# EAGLE design beacon (EAGLE 9.3.1)
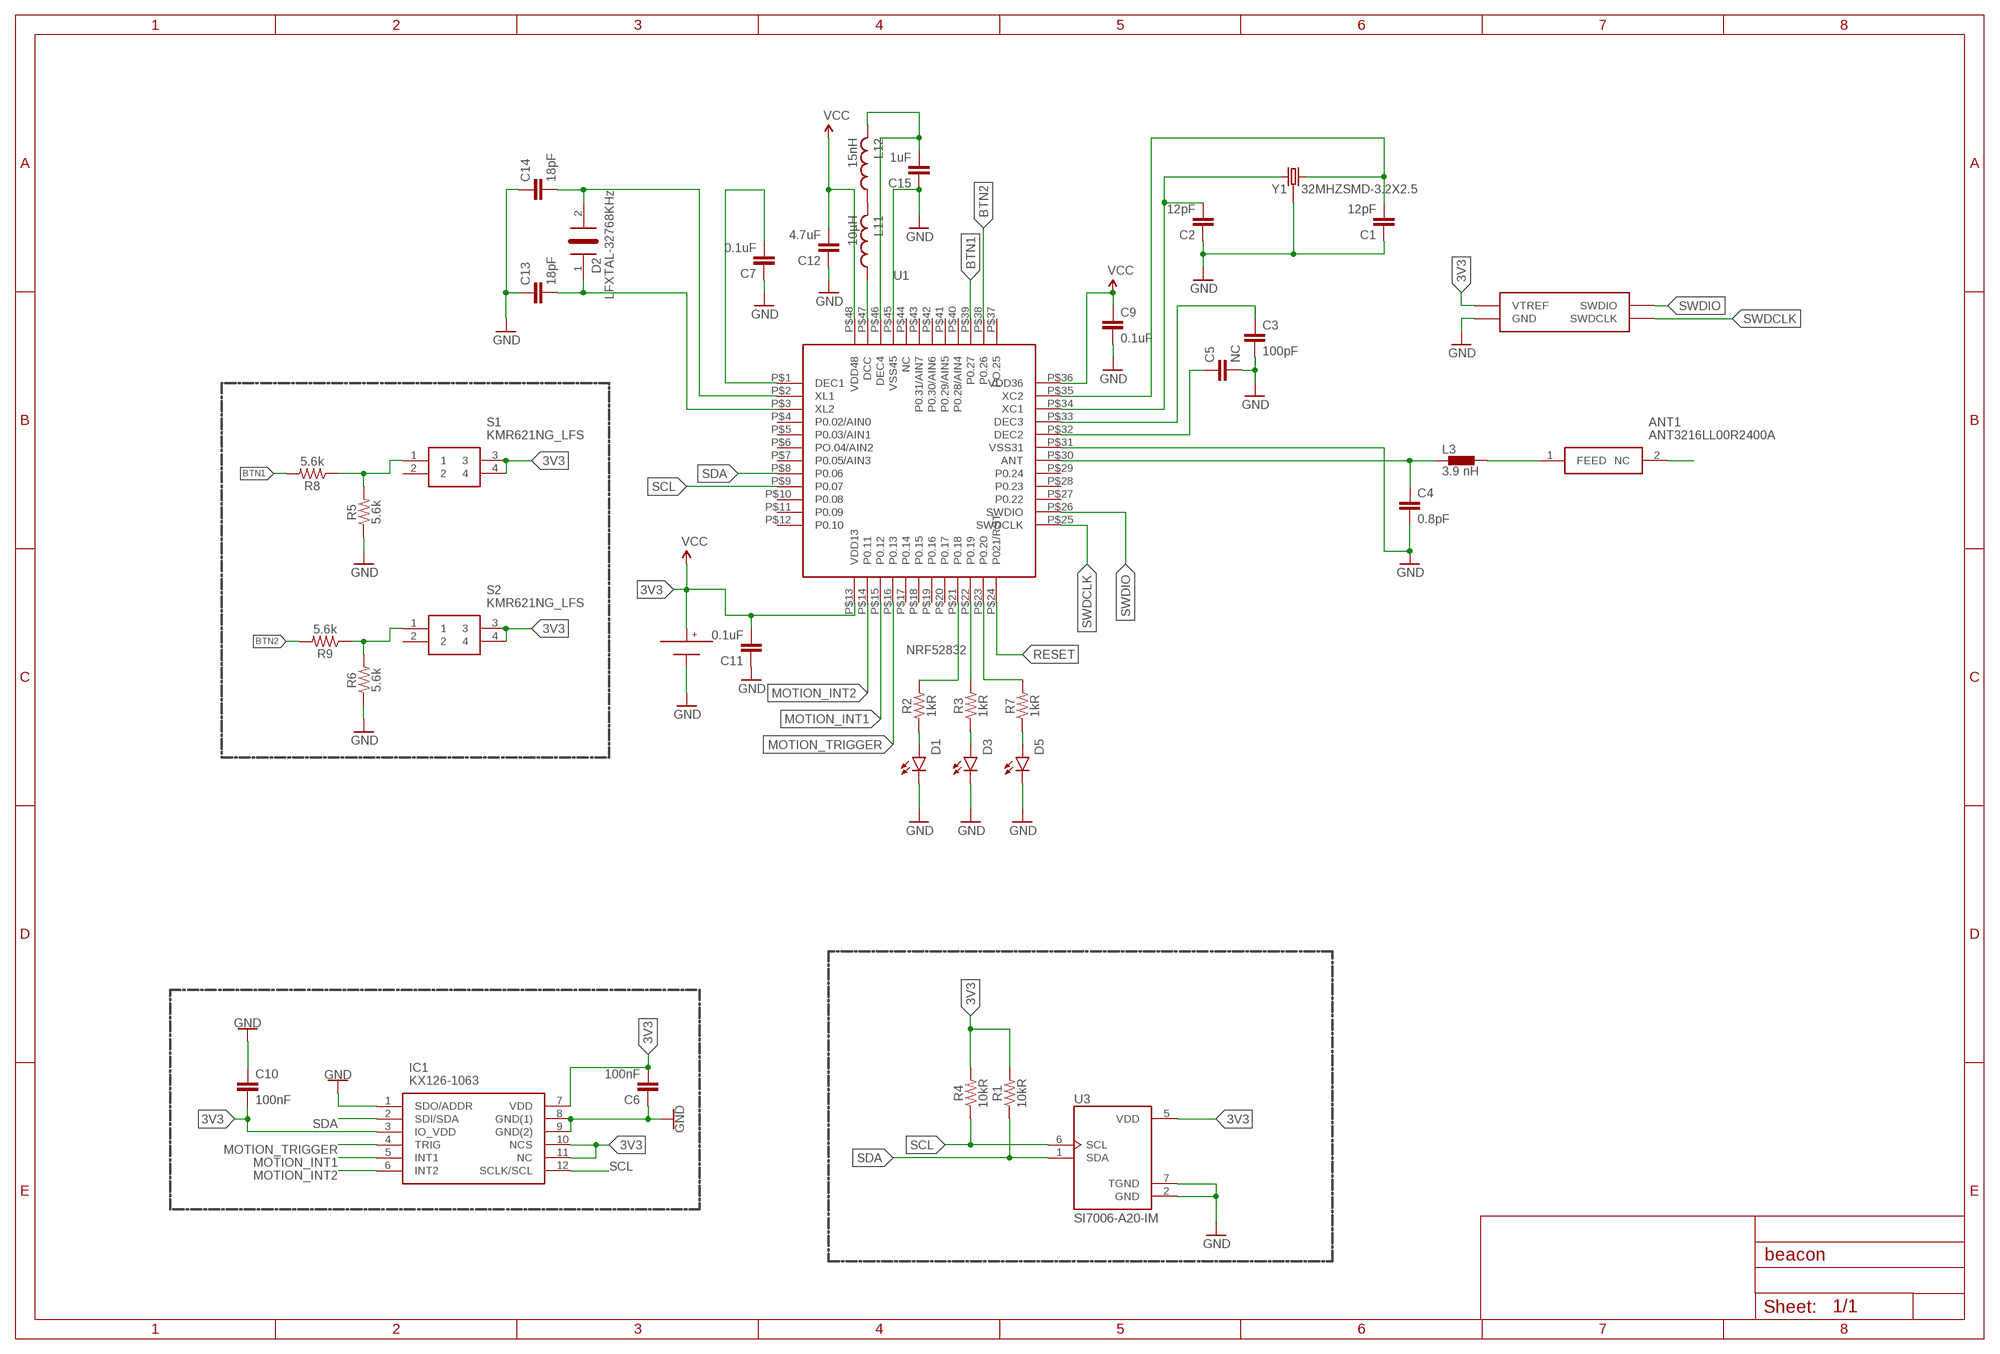
[diagram p0: schematic, sheet 1]

## Parts
ANT1  ANT3216LL00R2400A  [ANTC3216X135N]
C1  12pF  0.1UF-0603-25V-5%  [0603]
C2  12pF  0.1UF-0603-25V-5%  [0603]
C3  100pF  0.1UF-0603-25V-5%  [0603]
C4  0.8pF  0.1UF-0603-25V-5%  [0603]
C5  NC  0.1UF-0603-25V-5%  [0603]
C6  100nF  1.5PF-0603-50V-16.667%  [0603]
C7  0.1uF  0.1UF-0603-25V-5%  [0603]
C9  0.1uF  0.1UF-0603-25V-5%  [0603]
C10  100nF  1.5PF-0603-50V-16.667%  [0603]
C11  0.1uF  0.1UF-0603-25V-5%  [0603]
C12  4.7uF  0.1UF-0603-25V-5%  [0603]
C13  18pF  0.1UF-0603-25V-5%  [0603]
C14  18pF  0.1UF-0603-25V-5%  [0603]
C15  1uF  0.1UF-0603-25V-5%  [0603]
D1  LED0603  [LED-0603]
D2  LFXTAL-32768KHz  LFXTAL009678  [DIOC3215X90N]
D3  LED0603  [LED-0603]
D5  LED0603  [LED-0603]
IC1  KX126-1063  [2X2X0.9MMLGA]
J1  JTAG-PROGJTAG_SMALL  [JTAG_PROG_SMALL]
L3  3.9 nH  0402IND.KW  [0402]
L11  10µH  INDUCTOR_0603_N  [RESC0603_N]
L12  15nH  INDUCTOR_0402_N  [RESC0402_N]
R1  10kR  5.6KOHM-0603-1/10W-1%  [0603]
R2  1kR  5.6KOHM-0603-1/10W-1%  [0603]
R3  1kR  5.6KOHM-0603-1/10W-1%  [0603]
R4  10kR  5.6KOHM-0603-1/10W-1%  [0603]
R5  5.6k  5.6KOHM-0603-1/10W-1%  [0603]
R6  5.6k  5.6KOHM-0603-1/10W-1%  [0603]
R7  1kR  5.6KOHM-0603-1/10W-1%  [0603]
R8  5.6k  5.6KOHM-0603-1/10W-1%  [0603]
R9  5.6k  5.6KOHM-0603-1/10W-1%  [0603]
S1  KMR621NG_LFS  [KMR621NG]
S2  KMR621NG_LFS  [KMR621NG]
U1  NRF52832  [QFN-48]
U3  SI7006-A20-IM  [SON100P300X300X80-7N]
U$1  BAT-HLD-001  [BAT-HLD-001]
Y1  32MHZSMD-3.2X2.5  CRYSTAL-26MHZSMD-3.2X2.5  [CRYSTAL-SMD-3.2X2.5MM]

## Nets
3V3: C6.2 C9.1 C10.2 C11.2 C12.2 IC1.3(IO_VDD) IC1.7(VDD) IC1.10(NCS) IC1.11(NC) J1.VREF(VTREF) R1.2 R4.2 S1.3 S1.4 S2.3 S2.4 U1.P$13(VDD13) U1.P$36(VDD36) U1.P$48(VDD48) U3.5(VDD) U$1.+@1(+) U$1.+@2(+) ; supply symbol labelled VCC
BTN1: R8.2 U1.P$39(P0.27)
BTN2: R9.2 U1.P$38(P0.26)
DEC4: C15.2 L12.2 U1.P$46(DEC4)
GND: C1.1 C2.1 C3.2 C4.2 C5.2 C6.1 C7.1 C9.2 C10.1 C11.1 C12.1 C13.1 C14.1 C15.1 D1.C D3.C D5.C IC1.1(SDO/ADDR) IC1.8(GND(1)) IC1.9(GND(2)) J1.GND R5.1 R6.1 U1.P$31(VSS31) U1.P$45(VSS45) U3.2(GND) U3.7(TGND) U$1.- Y1.2 Y1.4
MOTION_INT1: IC1.5(INT1) U1.P$15(P0.12)
MOTION_INT2: IC1.6(INT2) U1.P$14(P0.11)
MOTION_TRIGGER: IC1.4(TRIG) U1.P$16(P0.13)
N$1: ANT1.1(FEED) L3.2
N$2: C2.2 U1.P$34(XC1) Y1.1
N$3: C4.1 L3.1 U1.P$30(ANT)
N$4: C14.2 D2.2(A) U1.P$2(XL1)
N$5: R7.2 U1.P$23(P0.20)
N$6: ANT1.2(NC)
N$7: R3.2 U1.P$22(P0.19)
N$8: R2.2 U1.P$21(P0.18)
N$9: C13.2 D2.1(K) U1.P$3(XL2)
N$10: C1.2 U1.P$35(XC2) Y1.3
N$11: R5.2 R8.1 S1.1
N$12: C7.2 U1.P$1(DEC1)
N$14: R6.2 R9.1 S2.1
N$16: D1.A R2.1
N$18: D3.A R3.1
N$19: D5.A R7.1
N$27: L11.2 L12.1
N$28: C3.1 U1.P$33(DEC3)
N$29: L11.1 U1.P$47(DCC)
N$47: C5.1 U1.P$32(DEC2)
RESET: U1.P$24(P021/RST)
SCL: IC1.12(SCLK/SCL) R4.1 U1.P$9(P0.07) U3.6(SCL)
SDA: IC1.2(SDI/SDA) R1.1 U1.P$8(P0.06) U3.1(SDA)
SWDCLK: J1.SCK(SWDCLK) U1.P$25(SWDCLK)
SWDIO: J1.DIO(SWDIO) U1.P$26(SWDIO)
Unconnected: S1.2 S2.2 U1.P$4(P0.02/AIN0) U1.P$5(P0.03/AIN1) U1.P$6(PO.04/AIN2) U1.P$7(P0.05/AIN3) U1.P$10(P0.08) U1.P$11(P0.09) U1.P$12(P0.10) U1.P$17(P0.14) U1.P$18(P0.15) U1.P$19(P0.16) U1.P$20(P0.17) U1.P$27(P0.22) U1.P$28(P0.23) U1.P$29(P0.24) U1.P$37(PO.25) U1.P$40(P0.28/AIN4) U1.P$41(P0.29/AIN5) U1.P$42(P0.30/AIN6) U1.P$43(P0.31/AIN7) U1.P$44(NC)

## Library data of the parts
ANT1 = IoTMakers:ANT3216LL00R2400A: Antennas 1W 2.4-2.5GHz ANTENNA Source: Datasheet <https://componentsearchengine.com/Datasheets/1/ANT3216LL00R2400A.pdf>; DESCRIPTION: Antennas 1W 2.4-2.5GHz ANTENNA; HEIGHT: 1.35mm; MANUFACTURER_NAME: YAGEO (PHYCOMP); MANUFACTURER_PART_NUMBER: ANT3216LL00R2400A; MOUSER_PART_NUMBER: 603-ANT3216LL00R2400
C1-C5 C12-C15 = SparkFun-Capacitors:0.1UF: 0.1µF ceramic capacitors A capacitor is a passive two-terminal electrical component used to store electrical energy temporarily in an electric field.; PROD_ID: CAP-08604; VALUE: 0.1uF
C6 C10 = SparkFun-Capacitors:1.5PF: 1.5pF ceramic capacitors A capacitor is a passive two-terminal electrical component used to store electrical energy temporarily in an electric field.; PROD_ID: CAP-08763; VALUE: 1.5pF
C7 C9 C11 = SparkFun-Capacitors:0.1UF: 0.1µF ceramic capacitors A capacitor is a passive two-terminal electrical component used to store electrical energy temporarily in an electric field.; PROD_ID: CAP-08604
D1 D3 D5 = SparkFun-LED:LED: LED (Generic) Standard schematic elements and footprints for 5mm, 3mm, 1206, and 0603 sized LEDs. Generic LEDs with no color specified.
D2 = SamacSys:LFXTAL009678: IQD FREQUENCY PRODUCTS - LFXTAL009678 - CRYSTAL, 32.768KHZ, 12.5PF, SMD Source: Datasheet <http://www.farnell.com/datasheets/1852967.pdf>; ARROW_PART_NUMBER: LFXTAL009678; ARROW_PRICE/STOCK: http://uk.rs-online.com/web/p/products/1463933; DESCRIPTION: IQD FREQUENCY PRODUCTS - LFXTAL009678 - CRYSTAL, 32.768KHZ, 12.5PF, SMD; HEIGHT: 0.9mm; MANUFACTURER_NAME: IQD; MANUFACTURER_PART_NUMBER: LFXTAL009678; RS_PART_NUMBER: 1463933; RS_PRICE/STOCK: http://uk.rs-online.com/web/p/products/1463933
IC1 = IoTMakers:KX126-1063: TRI-AXIS, USER SELECTABLE 2G, 4G, 8G, DIGITAL (I2C/SPI) OUTPUT, INTEGRATED PEDOMETER, FIFO/FILO BUFFER, 2X2X0.9MM LGA - KX126-1063 Source: Datasheet <http://kionixfs.kionix.com/en/datasheet/KX126-1063-Specifications-Rev-1.0.pdf>; DESCRIPTION: TRI-AXIS, USER SELECTABLE 2G, 4G, 8G, DIGITAL (I2C/SPI) OUTPUT, INTEGRATED PEDOMETER, FIFO/FILO BUFFER, 2X2X0.9MM LGA - KX126-1063; DIGIKEY_PART_NUMBER: 1191-1058-2-ND; HEIGHT: mm; MANUFACTURER_NAME: Kionix; MANUFACTURER_PART_NUMBER: KX126-1063
J1 = IoTMakers:JTAG-PROG
L3 = inductors:0402IND.KW
L11 L12 = Nordic_nRF:INDUCTOR: Generic chip inductor
R1-R4 R7 = SparkFun-Resistors:5.6KOHM: 5.6kΩ resistor A resistor is a passive two-terminal electrical component that implements electrical resistance as a circuit element. Resistors act to reduce current flow, and, at the same time, act to lower voltage levels within circuits. - Wikipedia; PROD_ID: RES-12378; VALUE: 5.6k
R5 R6 R8 R9 = SparkFun-Resistors:5.6KOHM: 5.6kΩ resistor A resistor is a passive two-terminal electrical component that implements electrical resistance as a circuit element. Resistors act to reduce current flow, and, at the same time, act to lower voltage levels within circuits. - Wikipedia; PROD_ID: RES-12378
S1 S2 = SamacSys:KMR621NG_LFS: IP67 Black Button Tactile Switch, SPST-NO 50 mA 2.11mm Surface Mount Source: Datasheet <http://www.ckswitches.com/media/1907/kmr6.pdf>; ARROW_PART_NUMBER: KMR621NG LFS; ARROW_PRICE/STOCK: https://www.arrow.com/en/products/kmr621nglfs/ck; DESCRIPTION: IP67 Black Button Tactile Switch, SPST-NO 50 mA 2.11mm Surface Mount; HEIGHT: mm; MANUFACTURER_NAME: C & K COMPONENTS; MANUFACTURER_PART_NUMBER: KMR621NG LFS; RS_PART_NUMBER: 1359408P; RS_PRICE/STOCK: http://uk.rs-online.com/web/p/products/1359408P
U1 = Kris:NRF52832: nRF52832 QFAA QFN-48 SoC
U3 = IoTMakers:SI7006-A20-IM: SENS HUMI/TEMP 3.6V I2C 5% 6DFN; AVAILABILITY: Unavailable; DESCRIPTION: Temp/Humidity Sensor, +/-1deg c, Dfn-6; MF: Silicon Labs; MP: SI7006-A20-IM; PACKAGE: DFN-6 Silicon Labs; PRICE: None
U$1 = IoTMakers:BAT-HLD-001: Linx Technologies BAT-HLD-001 surface mount CR2032 single-cell holder digikey: BAT-HLD-001-ND; AVAILABILITY: Unavailable; DESCRIPTION: CR2032 Phosphor Bronze / Nickel Plated 20 mm Cell Size Battery Holder; MF: Linx; MP: BAT-HLD-001; PACKAGE: None; PRICE: None
Y1 = IoTMakers:CRYSTAL-26MHZ: 26MHz Crystal w/ Ground Pin Digikey Example <http://www.digikey.com/product-detail/en/epson/TSX-3225%2026.0000MF09Z-AC3/SER3627CT-ND/1802878> Frequency: 26MHz Frequency Stability: ±9ppm Frequency Tolerance: ±10ppm Load Capacitance: 9pF SparkFun Products: SparkFun ESP32 Thing <https://www.sparkfun.com/products/13907> SparkFun ESP8266 Thing Dev Board <https://www.sparkfun.com/products/13711>; PROD_ID: XTAL-12454

## Board
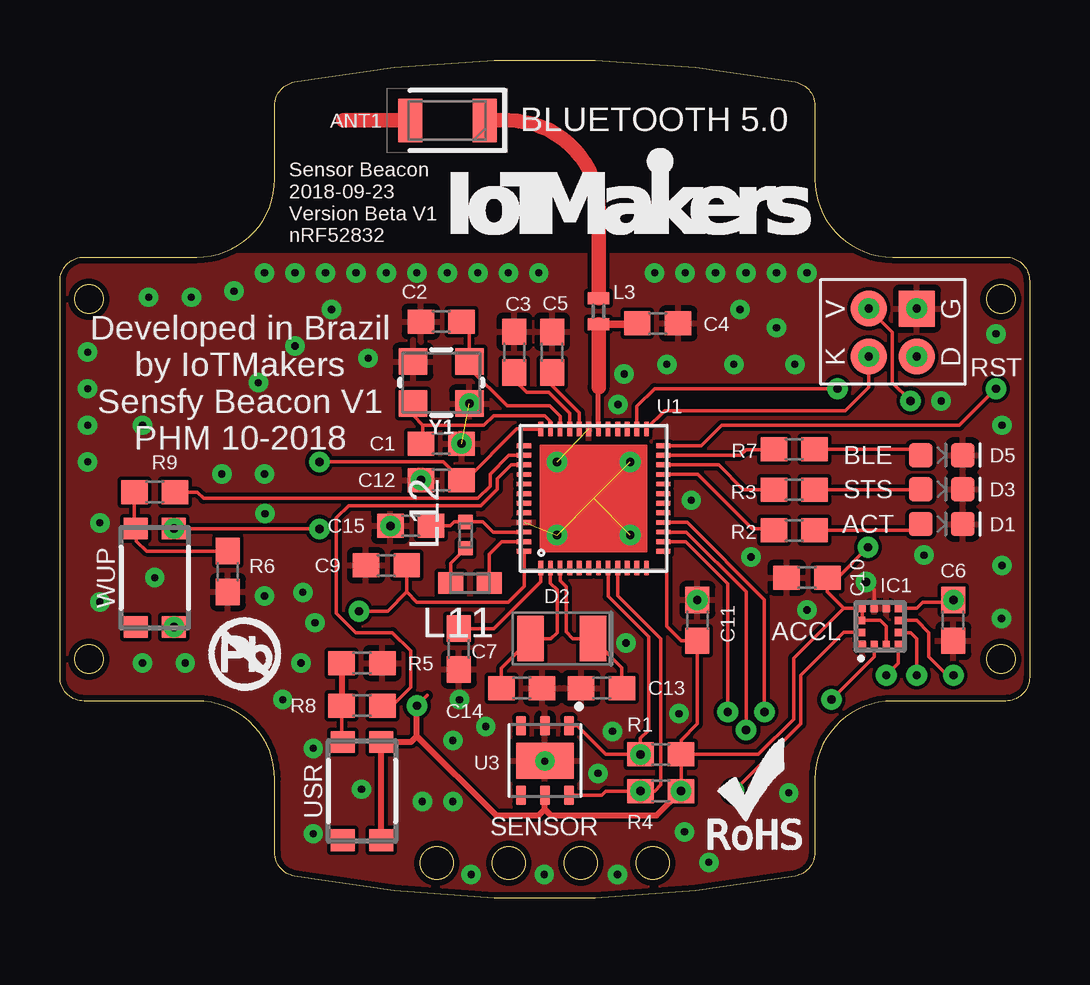
[diagram p1: board, top side]
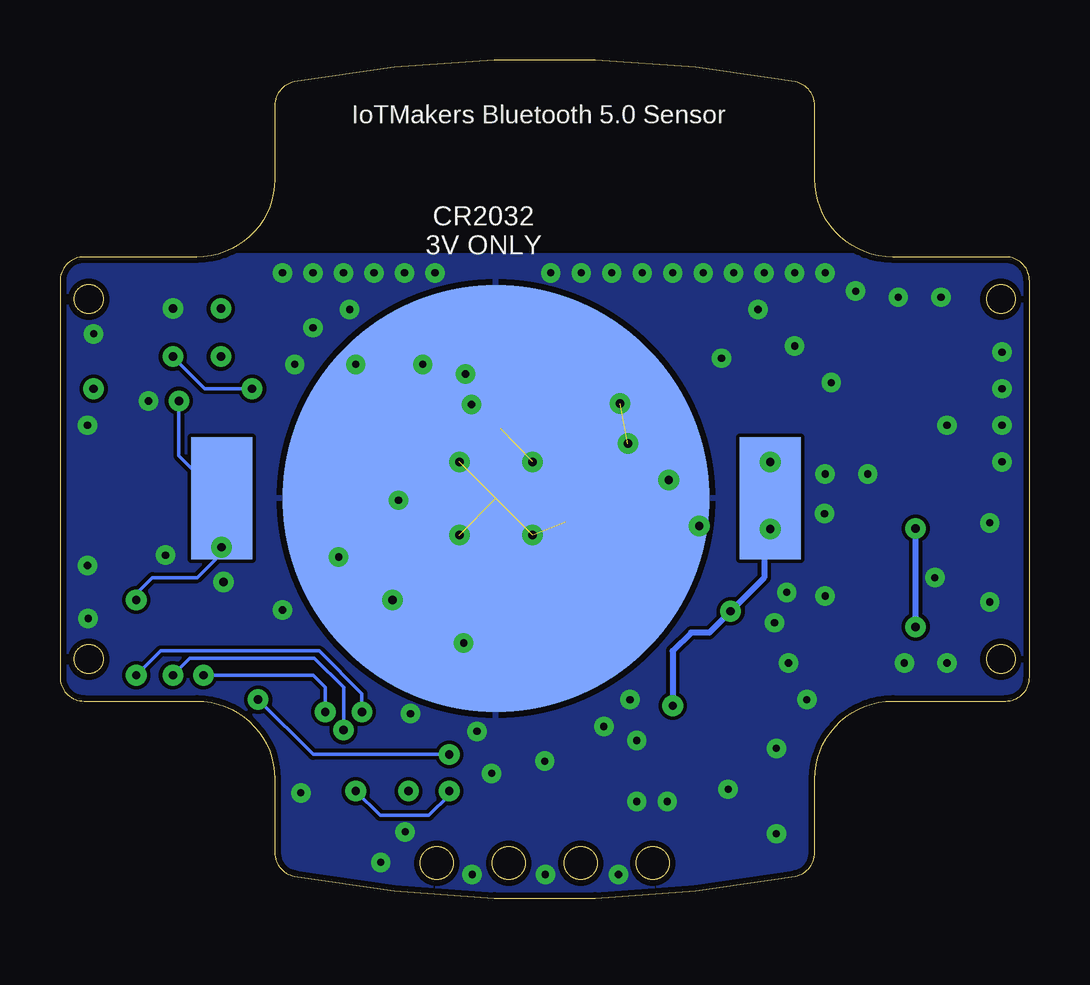
[diagram p2: board, bottom side, seen from below]

Size 40.4 x 34.92 mm. Coordinates in mm from the lower left corner, seen from the top.
Outline: 40.4,9.21 arc-90 39.4,8.21 34.7,8.21 arc90 31.45,4.96 31.45,1.9 arc-80 30.63,0.92 arc-21 9.77,0.92 arc-80 8.95,1.9 8.95,4.96 arc90 5.7,8.21 1,8.21 arc-90 0,9.21 0,25.71 arc-90 1,26.71 5.7,26.71 arc90 8.95,29.96 8.95,33.02 arc-80 9.77,34.01 arc-21 30.63,34.01 arc-80 31.45,33.02 31.45,29.96 arc90 34.7,26.71 39.4,26.71 arc-90 40.4,25.71 40.4,9.21
Outline: circle at 24.7,1.46 radius 0.69
Outline: circle at 15.7,1.46 radius 0.69
Outline: circle at 18.7,1.46 radius 0.69
Outline: circle at 39.2,24.96 radius 0.6
Outline: circle at 39.2,9.96 radius 0.6
Outline: circle at 1.2,9.96 radius 0.6
Outline: circle at 1.2,24.96 radius 0.6
Outline: circle at 21.7,1.46 radius 0.69
Copper layers (1*16): Top 0.035mm / dielectric 1.5mm / Bottom 0.035mm
Design rules "PCBWay": minimum track width 6mil, minimum drill 0.3mm, track to track 6mil, track to pad 6mil, pad to pad 6mil, via to via 6mil, smd to smd 6mil, copper to edge 10mil, drill to drill 6mil, minimum pad ring 12mil, minimum via ring 10mil, stop-mask expansion 4mil, vias tented up to drill 25mil, thermal gap 10mil

### Footprints (pad centres in the part's own frame; a part is rotated, then mirrored left to right if it is on the bottom)
ANTC3216X135N = smd 1 x 1.8: 1 -1.55,0; 2 1.55,0
0603 = smd 1.1 x 1: 1 -0.85,0; 2 0.85,0
LED-0603 = smd 1 x 1: A -0.877,0; C 0.877,0
DIOC3215X90N = smd 1.1 x 1.9: 1 -1.5,0; 2 1.1,0
2X2X0.9MMLGA = smd 0.35 x 0.3: 1 -0.762,0.75; 2 -0.762,0.25; 3 -0.762,-0.25; 4 -0.762,-0.75; 7 0.762,-0.75; 8 0.762,-0.25; 9 0.762,0.25; 10 0.762,0.75 | smd 0.3 x 0.35: 5 -0.25,-0.775; 6 0.25,-0.775; 11 0.25,0.8; 12 -0.25,0.8
JTAG_PROG_SMALL = smd 1.5 x 1.5: DIO 4,0; GND 2,0; SCK 4,-2; VREF 2,-2
0402 = smd 0.5 x 0.9: 1 -0.55,0; 2 0.55,0
RESC0603_N = smd 1.05 x 0.9: 1 -0.8,0; 2 0.8,0
RESC0402_N = smd 0.6 x 0.6: 1 -0.55,0; 2 0.55,0
KMR621NG = smd 0.9 x 1: 1 -2.05,-0.8; 2 2.05,-0.8; 3 2.05,0.8; 4 -2.05,0.8
QFN-48 = smd 0.6 x 0.2: P$1 -2.9,2.2; P$2 -2.9,1.8; P$3 -2.9,1.4; P$4 -2.9,1; P$5 -2.9,0.6; P$6 -2.9,0.2; P$7 -2.9,-0.2; P$8 -2.9,-0.6; P$9 -2.9,-1; P$10 -2.9,-1.4; P$11 -2.9,-1.8; P$12 -2.9,-2.2; P$25 2.9,-2.2; P$26 2.9,-1.8; P$27 2.9,-1.4; P$28 2.9,-1; P$29 2.9,-0.6; P$30 2.9,-0.2; P$31 2.9,0.2; P$32 2.9,0.6; P$33 2.9,1; P$34 2.9,1.4; P$35 2.9,1.8; P$36 2.9,2.2 | smd 0.2 x 0.6: P$13 -2.2,-2.9; P$14 -1.8,-2.9; P$15 -1.4,-2.9; P$16 -1,-2.9; P$17 -0.6,-2.9; P$18 -0.2,-2.9; P$19 0.2,-2.9; P$20 0.6,-2.9; P$21 1,-2.9; P$22 1.4,-2.9; P$23 1.8,-2.9; P$24 2.2,-2.9; P$37 2.2,2.9; P$38 1.8,2.9; P$39 1.4,2.9; P$40 1,2.9; P$41 0.6,2.9; P$42 0.2,2.9; P$43 -0.2,2.9; P$44 -0.6,2.9; P$45 -1,2.9; P$46 -1.4,2.9; P$47 -1.8,2.9; P$48 -2.2,2.9
SON100P300X300X80-7N = smd 0.81 x 0.42: 1 -1.45,1; 2 -1.45,0; 3 -1.45,-1; 4 1.45,-1; 5 1.45,0; 6 1.45,1 | smd 1.5 x 2.4: 7 0,0
BAT-HLD-001 = smd 2.54 x 5.08: +@1 -11.43,0; +@2 11.43,0 | smd 17.78 x 17.78: - 0,0
CRYSTAL-SMD-3.2X2.5MM = smd 1.2 x 1.1: 1 -1.175,-0.875; 2 1.175,-0.875; 3 1.175,0.875; 4 -1.175,0.875

### Placement (x,y rotation side)
ANT1  16.14,32.4 180 top
C1  15.89,18.94 180 top
C2  15.89,24.02 0 top
C3  18.93,22.75 90 top
C4  24.9,23.94 0 top
C5  20.51,22.75 90 top
C6  37.22,11.57 90 top
C7  16.62,10.38 90 top
C9  13.6,13.86 180 top
C10  31.13,13.35 0 top
C11  26.55,11.57 270 top
C12  15.89,17.42 0 top
C13  22.57,8.76 0 top
C14  19.24,8.76 180 top
C15  14.62,15.51 0 top
D1  36.74,15.59 0 top
D2  20.71,10.81 180 top
D3  36.74,17.04 0 top
D5  36.74,18.46 0 top
IC1  34.17,11.32 90 top
J1  35.7,26.56 270 top
L3  22.44,24.45 90 top
L11  17.08,13.12 180 top
L12  16.9,15.13 90 top
R1  25.03,5.99 0 top
R2  30.59,15.33 180 top
R3  30.59,17.02 180 top
R4  25.03,4.46 0 top
R5  12.58,9.8 180 top
R6  7,13.61 90 top
R7  30.59,18.71 180 top
R8  12.58,8.02 0 top
R9  3.95,16.91 0 top
S1  12.58,4.46 270 top
S2  3.95,13.35 270 top
U1  22.24,16.65 90 top
U3  20.2,5.73 270 top
U$1  22.24,16.65 0 bottom
U$2  [LOGO_L]  16.14,27.58 0 top
U$3  [NO_PB_LOGO_0.120]  5.98,8.27 0 top
U$4  [ROHS_LOGO_0.18_IN]  26.81,1.92 0 top
Y1  15.89,21.48 180 top

### Tracks (layer width: path | path; a pad name or v marks a point on that pad's centre or on a via)
3V3  (via drill 0.35)
  Top 0.152: 19.29,19.55 19.04,19.55 16.9,17.42 C12.2 15.97,18.18 v10.81,18.18 | R1.2 R4.2 | U3.5 | J1.VREF 34.68,23.58 34.68,21.48 v35.44,20.72 | 15.3,8.45 v14.87,8.02 | 14.29,13.7 C9.1 14.45,12.76 | 36.88,12.08 C6.2 37.13,12.34 35.95,12.34 35.7,12.08 IC1.7 | IC1.10 33.42,11.62 IC1.11 34.17,11.57 34.42,11.32 IC1.3 | 33.67,14.37 v33.67,14.62 32.4,13.35 C10.2 31.98,12.76 32.65,12.08 | U1.P$13 25.28,14.31 25.28,11.32 25.88,10.72 C11.2 26.55,7.26 25.88,6.58 R1.2 | 32.65,12.08 IC1.10 | IC1.10 | S2.4 4.77,15.38 v10.81,15.38 | U1.P$48 19.34,12.99 18.68,12.34 14.87,12.34 14.45,12.76 | 14.45,12.76 13.65,11.96 v12.46,11.96 | R1.2 29.09,5.99 30.57,7.46 30.57,10 32.65,12.08
  Top 0.178: U1.P$36 19.29,19.55
  Top 0.254: S1.3 S1.4 14.63,6.51 14.87,6.75 | 14.87,6.75 v14.87,8.02 | 14.87,6.75 18.17,3.45 19.95,3.45 20.2,3.7 | 20.2,3.7 U3.5 | 20.2,3.7 20.46,3.45 24.86,3.45 R4.2
  Bottom 0.152: v35.44,20.72 35.44,18.43 U$1.+@1 v33.67,14.62 33.67,14.37 34.68,13.35 36.55,13.35 37.22,12.68 C6.2 | v10.81,18.18 U$1.+@2 v10.81,15.38
  Bottom 0.254: U$1.+@2 11.06,16.4 11.06,13.35 v12.46,11.96 13.35,11.07 14.11,11.07 14.87,10.3 v14.87,8.02 | S2.3 S2.4
  other vias: 25.88,4.46 33.7,24.56 37.22,12.42 4.75,11.3 4.75,15.4
BTN1
  Top 0.152: U1.P$39 18.81,18.05 18.22,17.47 18.22,17.04 17.54,16.35 12.02,16.35 11.52,15.84 11.52,11.88 12.33,11.07 13.85,11.07 14.62,10.3 14.62,8.78 13.85,8.02 R8.2
BTN2
  Top 0.152: U1.P$38 18.7,18.45 17.92,17.67 17.92,17.16 17.41,16.65 5.98,16.65 5.73,16.91 R9.2
DEC4
  Top 0.152: C15.2 16.27,15.51 16.44,15.68 L12.2 17.62,15.68 18.05,15.25 U1.P$46
GND  (via drill 0.3, 0.35)  (6 unrouted)
  Top 0.152: IC1.9 33.92,12.84 v33.59,13.17
  Bottom 0.152: 14.91,16.65 C15.1
  other vias: 23.76,18.18 20.71,18.18 17.74,7.16 20.71,15.13 23.76,15.13 23.25,20.57 23.51,21.84 19.95,26.05 18.68,26.05 17.41,26.05 16.14,26.05 14.87,26.05 13.6,26.05 12.33,26.05 11.06,26.05 9.79,26.05 8.52,26.05 24.78,26.05 26.05,26.05 10.12,12.74 10.63,11.47 10.04,9.8 16.65,8.27 23.58,10.63 25.79,7.69 39.25,13.86 36.71,20.72 28.08,22.24 25.28,22.24 27.32,26.05 28.59,26.05 29.86,26.05 29.86,23.77 28.33,24.53 7.25,25.29 5.47,25.04 3.69,25.04 1.15,22.75 1.15,21.23 1.15,19.7 1.15,18.18 1.66,15.64 1.66,12.34 3.44,9.8 5.22,9.8 9.28,8.27 10.55,6.24 10.55,2.68 31.13,26.05 27.04,1.49 20.18,0.98 15.1,4.03 16.37,6.57 39.23,11.65 36,14.29 12.84,22.5 8.52,17.67 6.74,17.67 9.79,23 8.27,21.48 22.41,5.2 23.02,6.95 20.2,5.71 16.37,4.03 12.56,4.54 3.95,13.35 8.55,16.02 8.52,12.59 39.25,19.7 39,23.51 30.62,22.24 3.44,19.7 11.31,24.53 23.23,0.98 17.13,0.98 26.02,2.76 35.7,24.56 26.55,12.42 31.13,12.01 30.36,4.39 26.3,16.58 28.79,14.22 17.06,20.61 16.74,18.94 15.04,17.42 13.77,15.51
  pour Top: -2.66,26.81 41.29,26.81 41.29,-1.13 -2.66,-1.13
  pour Bottom: -2.66,26.81 41.29,26.81 41.29,-1.63 -2.66,-1.63
MOTION_INT1  (via drill 0.35)
  Top 0.152: IC1.5 35.44,11.07 35.7,10.81 v35.7,9.29 | v28.59,7 28.59,12.77 26.1,15.25 U1.P$15
  Bottom 0.152: v35.7,9.29 34.99,10 29.8,10 28.59,8.78 v28.59,7
MOTION_INT2  (via drill 0.35)
  Top 0.152: IC1.6 35.7,11.57 36.21,11.07 36.21,10.05 36.97,9.29 v37.22,9.29 | U1.P$14 26.07,14.85 27.82,13.1 v27.82,7.76
  Bottom 0.152: v37.22,9.29 36.21,10.3 29.6,10.3 27.82,8.53 v27.82,7.76
MOTION_TRIGGER  (via drill 0.35)
  Top 0.152: IC1.4 34.92,9.78 v34.43,9.29 | U1.P$16 26.13,15.65 29.35,12.44 v29.35,7.76
  Bottom 0.152: v34.43,9.29 29.86,9.29 29.35,8.78 v29.35,7.76
N$1
  Top 0.61: L3.2 22.44,28.64 arc90 18.68,32.4 ANT1.1
N$2
  Top 0.152: U1.P$34 20.84,20.09 20.41,20.52 18.63,20.52 17.06,22.08 Y1.1 17.06,23.7 C2.2
N$3
  Top 0.2: U1.P$30 22.44,21.27
  Top 0.305: L3.1 24.31,23.9 C4.1
  Top 0.406: 22.44,21.27 arc-90 22.44,21.28
  Top 0.61: L3.1 22.44,21.28
N$4
  Top 0.152: C14.2 18.39,9.59 D2.2 20.46,10.81 20.71,11.07 20.71,12.84 20.44,13.12 U1.P$2
N$5
  Top 0.152: U1.P$23 28.35,18.45 28.59,18.69 29.72,18.69 R7.2
N$6
  Top 0.61: ANT1.2 11.8,32.4
N$7
  Top 0.152: U1.P$22 27.44,18.05 28.47,17.02 R3.2
N$8
  Top 0.152: U1.P$21 26.57,17.65 28.84,15.38 29.69,15.38 R2.2
N$9
  Top 0.152: C13.2 23.42,9.61 D2.1 21.37,10.81 21.09,11.09 21.09,12.97 20.84,13.23 U1.P$3
N$10
  Top 0.152: U1.P$35 20.44,19.88 20.2,20.11 18.07,20.11 17.66,19.7 15.12,19.7 | Y1.3 14.71,20.12 15.12,19.7 | C1.2 15.12,19.03 15.12,19.7
N$11
  Top 0.152: R8.1 11.73,6.56 S1.1
  Top 0.254: R5.2 R8.1
N$12
  Top 0.152: U1.P$1 20.04,13.18 18.08,11.23 C7.2
N$14
  Top 0.152: R9.1 3.1,15.45 S2.1 3.19,15.36 3.19,14.88 3.61,14.46 R6.2
N$16
  Top 0.152: R2.1 35.61,15.33 D1.A
N$18
  Top 0.152: R3.1 35.85,17.02 D3.A
N$19
  Top 0.152: R7.1 35.61,18.71 D5.A
N$27
  Top 0.152: L12.1 16.28,13.96 L11.2
N$28
  Top 0.152: U1.P$33 21.24,20.19 20.36,21.07 19.44,21.07 18.93,21.58 C3.1
N$29
  Top 0.152: U1.P$47 18.4,14.85 17.88,14.33 L11.1
N$47
  Top 0.152: U1.P$32 21.64,20.23 20.51,21.35 C5.1
RESET  (via drill 0.35)
  Top 0.152: U1.P$24 26.72,18.85 27.57,19.7 37.48,19.7 v39,21.23
SCL  (via drill 0.35)
  Top 0.152: U1.P$9 23.24,12.61 25.03,10.81 25.03,4.72 24.78,4.46 R4.1 22.74,4.46 22.56,4.28 U3.6 | IC1.12 32.65,11.07 30.87,9.29 30.87,7.26 v28.08,4.46
  Bottom 0.152: v28.08,4.46 27.06,3.45 25.03,3.45 24.18,4.3 R4.1
  other vias: 24.18,4.46
SDA  (via drill 0.35)
  Top 0.152: U1.P$8 22.84,12.58 24.52,10.89 24.52,7 24.18,6.66 R1.1 22.74,5.99 21.55,7.18 U3.1 | v32.14,8.27 33.92,10.05 IC1.2
  Bottom 0.152: R1.1 29.86,5.99 v32.14,8.27
  other vias: 24.18,5.99
SWDCLK  (via drill 0.35)
  Top 0.152: J1.SCK 33.7,21.29 32.73,20.32 25.2,20.32 U1.P$25
  other vias: 33.7,22.56
SWDIO  (via drill 0.35)
  Top 0.152: U1.P$26 24.04,20.49 24.78,21.23 v32.4,21.23
  Bottom 0.152: v32.4,21.23 34.36,21.23 J1.DIO
  other vias: 35.7,22.56

### Text on the board
tPlace: Sensor Beacon / 2018-09-23 / Version Beta V1 / nRF52832 | RST | Developed in Brazil / by IoTMakers / Sensfy Beacon V1 / PHM 10-2018 | BLE | STS | ACT
bPlace: CR2032 / 3V ONLY
tNames: BLUETOOTH 5.0 | WUP | ACCL | USR | SENSOR
bNames: IoTMakers Bluetooth 5.0 Sensor